# EAGLE design robot (EAGLE 6.1)
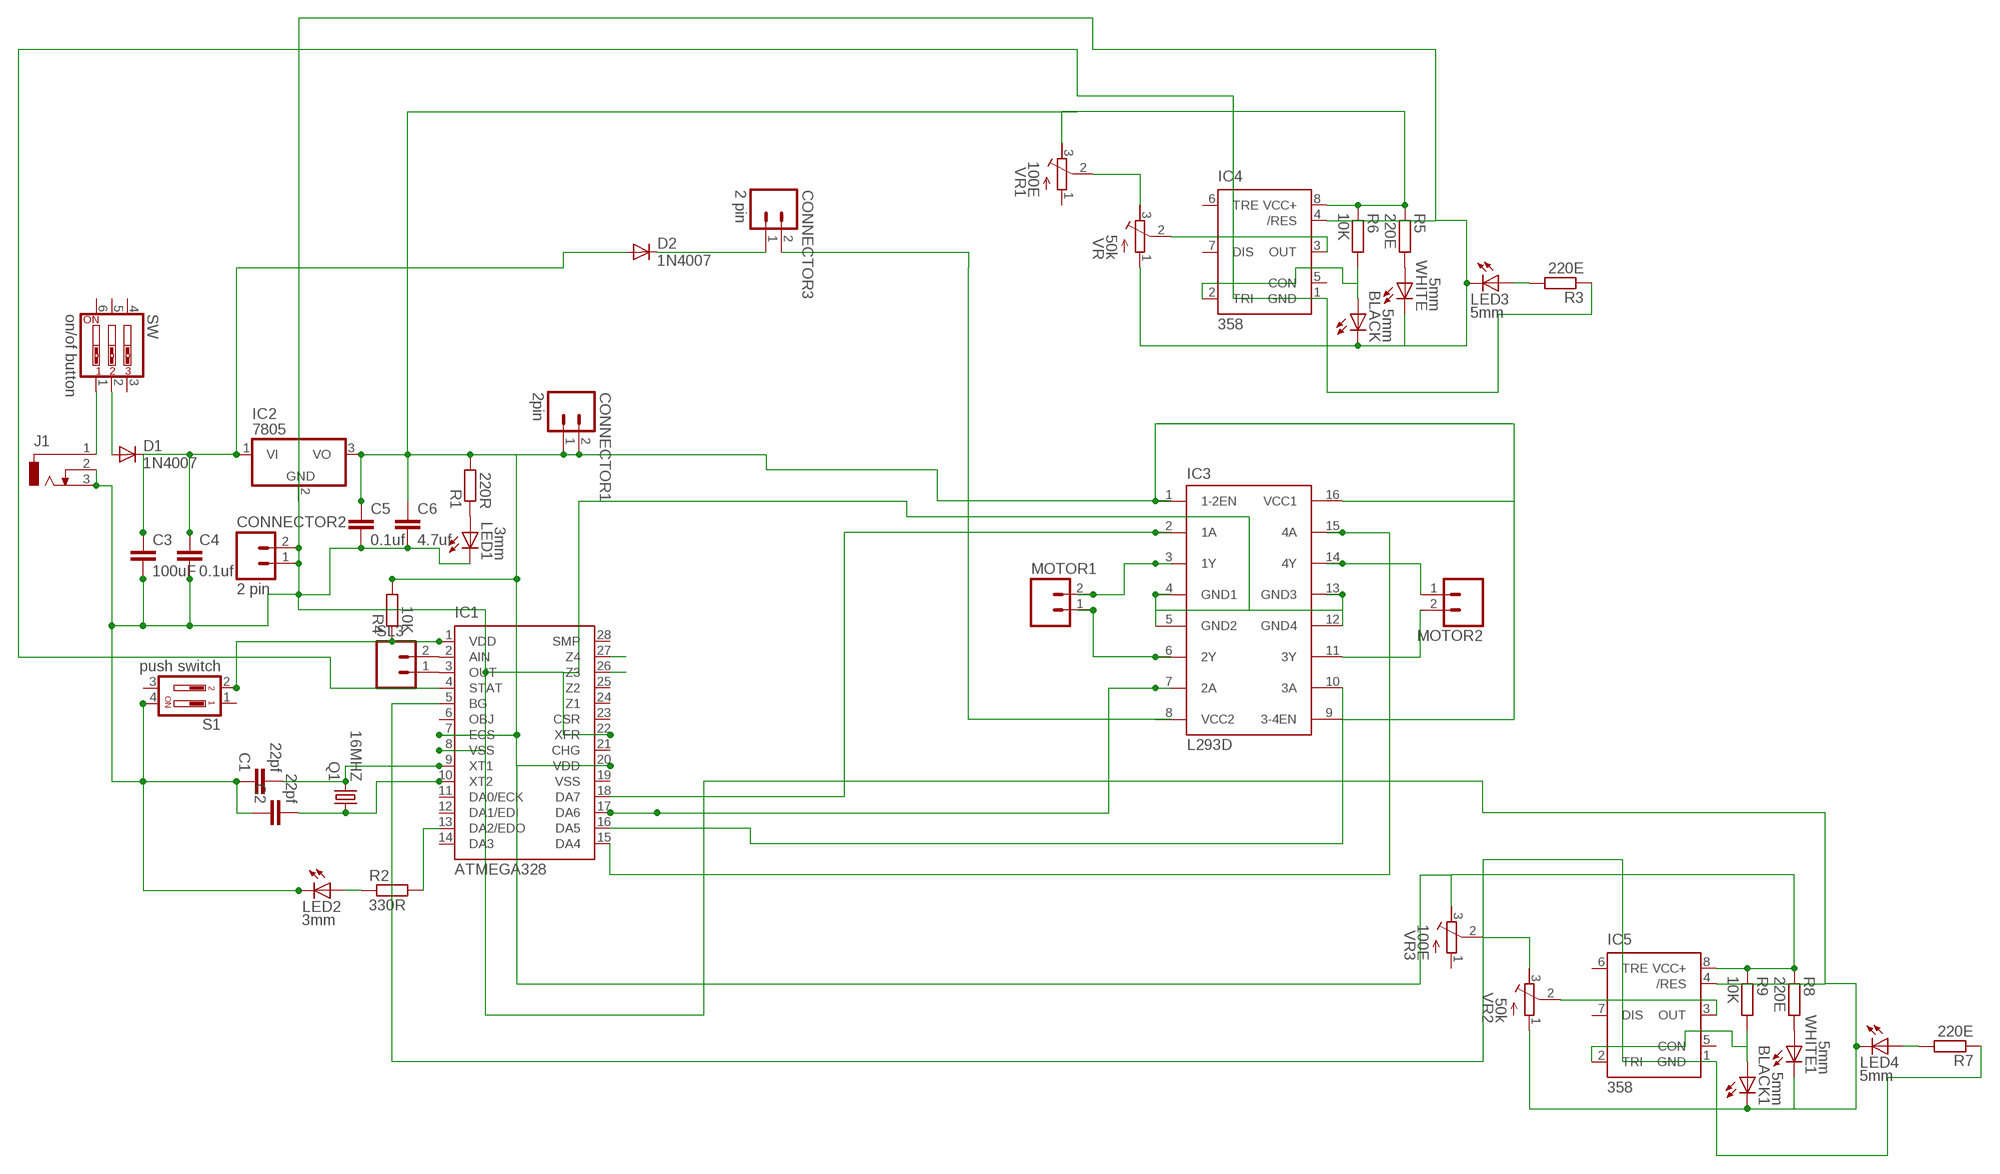
[diagram p0: schematic, sheet 1]

## Parts
BLACK  5mm  LED5MM  [LED5MM]
BLACK1  5mm  LED5MM  [LED5MM]
C1  22pf  C2.5/2  [C2.5-2]
C2  22pf  C2.5/2  [C2.5-2]
C3  100uF  C2.5/2  [C2.5-2]
C4  0.1uf  C2.5/2  [C2.5-2]
C5  0.1uf  C2.5/2  [C2.5-2]
C6  4.7uf  C2.5/2  [C2.5-2]
CONNECTOR1  2pin  M02  [02P]
CONNECTOR2  2 pin  M02  [02P]
CONNECTOR3  2 pin  M02  [02P]
D1  1N4007  1N4004  [DO41-10]
D2  1N4007  1N4004  [DO41-10]
IC1  ATMEGA328  QT9701BD  [DIL28-3]
IC2  7805  786TV  [TO220V]
IC3  L293D  [DIL16]
IC4  358  NE555  [DIL-08]
IC5  358  NE555  [DIL-08]
J1  DCJ0303  [DCJ0303]
LED1  3mm  LED3MM  [LED3MM]
LED2  3mm  LED3MM  [LED3MM]
LED3  5mm  LED5MM  [LED5MM]
LED4  5mm  LED5MM  [LED5MM]
MOTOR1  M02  [02P]
MOTOR2  M02  [02P]
Q1  16MHZ  CRYSTALHC49S  [HC49/S]
R1  220R  R-EU_0207/10  [0207/10]
R2  330R  R-EU_0207/10  [0207/10]
R3  220E  R-EU_0204/7  [0204/7]
R4  10K  R-EU_0207/10  [0207/10]
R5  220E  R-EU_0204/7  [0204/7]
R6  10K  R-EU_0204/7  [0204/7]
R7  220E  R-EU_0204/7  [0204/7]
R8  220E  R-EU_0204/7  [0204/7]
R9  10K  R-EU_0204/7  [0204/7]
S1  push switch  DP02  [DP-02]
SL3  M02  [02P]
SW  on/of button  SW_DIP-3  [EDG-03]
VR  50k  R-TRIMM64P  [RTRIM64P]
VR1  100E  R-TRIMM64P  [RTRIM64P]
VR2  50k  R-TRIMM64P  [RTRIM64P]
VR3  100E  R-TRIMM64P  [RTRIM64P]
WHITE  5mm  LED5MM  [LED5MM]
WHITE1  5mm  LED5MM  [LED5MM]

## Nets
N$1: C1.2 IC1.9(XT1) Q1.2
N$2: C2.2 IC1.10(XT2) Q1.1
N$3: J1.1 SW.1
N$4: CONNECTOR3.2 IC3.8(VCC2)
N$5: C3.1 C4.1 D1.C D2.A IC2.1(VI)
N$6: LED1.A R1.1
N$7: IC1.17(DA6) IC3.7(2A)
N$8: IC1.3(OUT) SL3.1
N$9: IC1.2(AIN) SL3.2
N$10: CONNECTOR3.1 D2.C
N$12: IC1.27(Z4)
N$13: IC1.26(Z3)
N$15: IC1.18(DA7) IC3.2(1A)
N$16: IC1.15(DA4) IC3.15(4A)
N$17: IC1.13(DA2/EDO) R2.2
N$18: D1.A SW.2
N$20: IC1.4(STAT) IC4.1(GND) R3.1
N$21: IC1.16(DA5) IC3.10(3A)
N$22: R5.2 WHITE.A
N$23: BLACK.A IC4.2(TRI) R6.2
N$24: IC4.3(OUT) VR.2(S)
N$25: IC3.14(4Y) MOTOR2.1
N$26: VR1.2(S) VR.3(A)
N$28: IC3.11(3Y) MOTOR2.2
N$29: LED3.A R3.2
N$31: IC1.1(VDD) R4.1 S1.2
N$32: LED2.A R2.1
N$33: C5.1 C6.1 CONNECTOR1.1 CONNECTOR1.2 IC1.7(ECS) IC1.20(VDD) IC2.3(VO) IC3.1(1-2EN) IC3.9(3-4EN) IC3.16(VCC1) IC4.8(VCC+) IC5.8(VCC+) R1.2 R4.2 R5.1 R6.1 R8.1 R9.1 VR1.3(A) VR3.3(A)
N$34: IC3.6(2Y) MOTOR1.1
N$35: IC3.3(1Y) MOTOR1.2
N$36: IC1.5(BG) IC5.1(GND) R7.1
N$37: R8.2 WHITE1.A
N$38: BLACK1.A IC5.2(TRI) R9.2
N$39: IC5.3(OUT) VR2.2(S)
N$40: VR2.3(A) VR3.2(S)
N$41: BLACK1.K(C) BLACK.K(C) C1.1 C2.1 C3.2 C4.2 C5.2 C6.2 CONNECTOR2.1 CONNECTOR2.2 IC1.8(VSS) IC1.22(XFR) IC2.2(GND) IC3.4(GND1) IC3.5(GND2) IC3.12(GND4) IC3.13(GND3) IC4.4(/RES) IC5.4(/RES) J1.2 J1.3 LED1.K(C) LED2.K(C) LED3.K(C) LED4.K(C) S1.4 VR2.1(E) VR.1(E) WHITE1.K(C) WHITE.K(C)
N$42: LED4.A R7.2
Unconnected: IC1.6(OBJ) IC1.11(DA0/ECK) IC1.12(DA1/EDI) IC1.14(DA3) IC1.19(VSS) IC1.21(CHG) IC1.23(CSR) IC1.24(Z1) IC1.25(Z2) IC1.28(SMP) IC4.5(CON) IC4.6(TRE) IC4.7(DIS) IC5.5(CON) IC5.6(TRE) IC5.7(DIS) S1.1 S1.3 SW.3 SW.4 SW.5 SW.6 VR1.1(E) VR3.1(E)

## Library data of the parts
BLACK BLACK1 LED1-LED4 WHITE WHITE1 = led:LED: LED OSRAM: - CHIPLED LG R971, LG N971, LY N971, LG Q971, LY Q971, LO R971, LY R971 LH N974, LH R974 LS Q976, LO Q976, LY Q976 LO Q996 - Hyper CHIPLED LW Q18S LB Q993, LB Q99A, LB R99A - SideLED LS A670, LO A670, LY A670, LG A670, LP A670 LB A673, LV A673, LT A673, LW A673 LH A674 LY A675 LS A676, LA A676, LO A676, LY A676, LW A676 LS A679, LY A679, LG A679 - Hyper Micro SIDELED® LS Y876, LA Y876, LO Y876, LY Y876 LT Y87S - SmartLED LW L88C, LW L88S LB L89C, LB L89S, LG L890 LS L89K, LO L89K, LY L89K LS L896, LA L896, LO L896, LY L896 - TOPLED LS T670, LO T670, LY T670, LG T670, LP T670 LSG T670, LSP T670, LSY T670, LOP T670, LYG T670 LG T671, LOG T671, LSG T671 LB T673, LV T673, LT T673, LW T673 LH T674 LS T676, LA T676, LO T676, LY T676, LB T676, LH T676, LSB T676, LW T676 LB T67C, LV T67C, LT T67C, LS T67K, LO T67K, LY T67K, LW E67C LS E67B, LA E67B, LO E67B, LY E67B, LB E67C, LV E67C, LT E67C LW T67C LS T679, LY T679, LG T679 LS T770, LO T770, LY T770, LG T770, LP T770 LB T773, LV T773, LT T773, LW T773 LH T774 LS E675, LA E675, LY E675, LS T675 LS T776, LA T776, LO T776, LY T776, LB T776 LHGB T686 LT T68C, LB T68C - Hyper Mini TOPLED® LB M676 - Mini TOPLED Santana® LG M470 LS M47K, LO M47K, LY M47K Source: http://www.osram.convergy.de LUXEON: - LUMILED® LXK2-PW12-R00, LXK2-PW12-S00, LXK2-PW14-U00, LXK2-PW14-V00 LXK2-PM12-R00, LXK2-PM12-S00, LXK2-PM14-U00 LXK2-PE12-Q00, LXK2-PE12-R00, LXK2-PE12-S00, LXK2-PE14-T00, LXK2-PE14-U00 LXK2-PB12-K00, LXK2-PB12-L00, LXK2-PB12-M00, LXK2-PB14-N00, LXK2-PB14-P00, LXK2-PB14-Q00 LXK2-PR12-L00, LXK2-PR12-M00, LXK2-PR14-Q00, LXK2-PR14-R00 LXK2-PD12-Q00, LXK2-PD12-R00, LXK2-PD12-S00 LXK2-PH12-R00, LXK2-PH12-S00 LXK2-PL12-P00, LXK2-PL12-Q00, LXK2-PL12-R00 Source: www.luxeon.com KINGBRIGHT: KA-3528ASYC Source: www.kingbright.com
C1-C6 = capacitor-wima:C: CAPACITOR naming: grid - package width
CONNECTOR1-CONNECTOR3 MOTOR1 MOTOR2 SL3 = con-amp-quick:M02: AMP QUICK CONNECTOR; OC_FARNELL: unknown; OC_NEWARK: unknown
D1 D2 = diode:1N4004: DIODE general purpose rectifier, 1 A
IC1 = quantum-research-group:QT9701B: Charge-Transfer Capacitance Sensor IC Source: http://data.qprox.com/downloads/datasheets/qt9701b.pdf; OC_FARNELL: unknown; OC_NEWARK: unknown
IC2 = linear:78*: Positive VOLTAGE REGULATOR Source: http://cache.national.com/ds/LM/LM78L05.pdf http://www.fairchildsemi.com/ds/LM/LM7805.pdf
IC3 = st-microelectronics:L293D: PUSH-PULL 4 CHANNEL DRIVER; MPN: L293D; OC_FARNELL: 9589619; OC_NEWARK: 56P8249
IC4 IC5 = st-microelectronics:NE555: General purpose bipolar Timer; MF: Arrow Electronics; MPN: NE555N; OC_FARNELL: 1467742; OC_NEWARK: 89K1486
J1 = con-jack:DCJ0303: DC POWER JACK Source: DCJ0303.pdf; OC_FARNELL: unknown; OC_NEWARK: unknown
Q1 = crystal:CRYSTAL: CRYSTAL; OC_FARNELL: 1667008; OC_NEWARK: unknown
R1-R9 = rcl:R-EU_: RESISTOR, European symbol
S1 = switch-dil:DP02: DIL/CODE SWITCH; MPN: MCDP02; OC_FARNELL: 1255233; OC_NEWARK: 26M1095
SW = special:SW_DIP-3: DIP SWITCH
VR VR1-VR3 = resistor:R-TRIMM: Trimm resistor

## Board
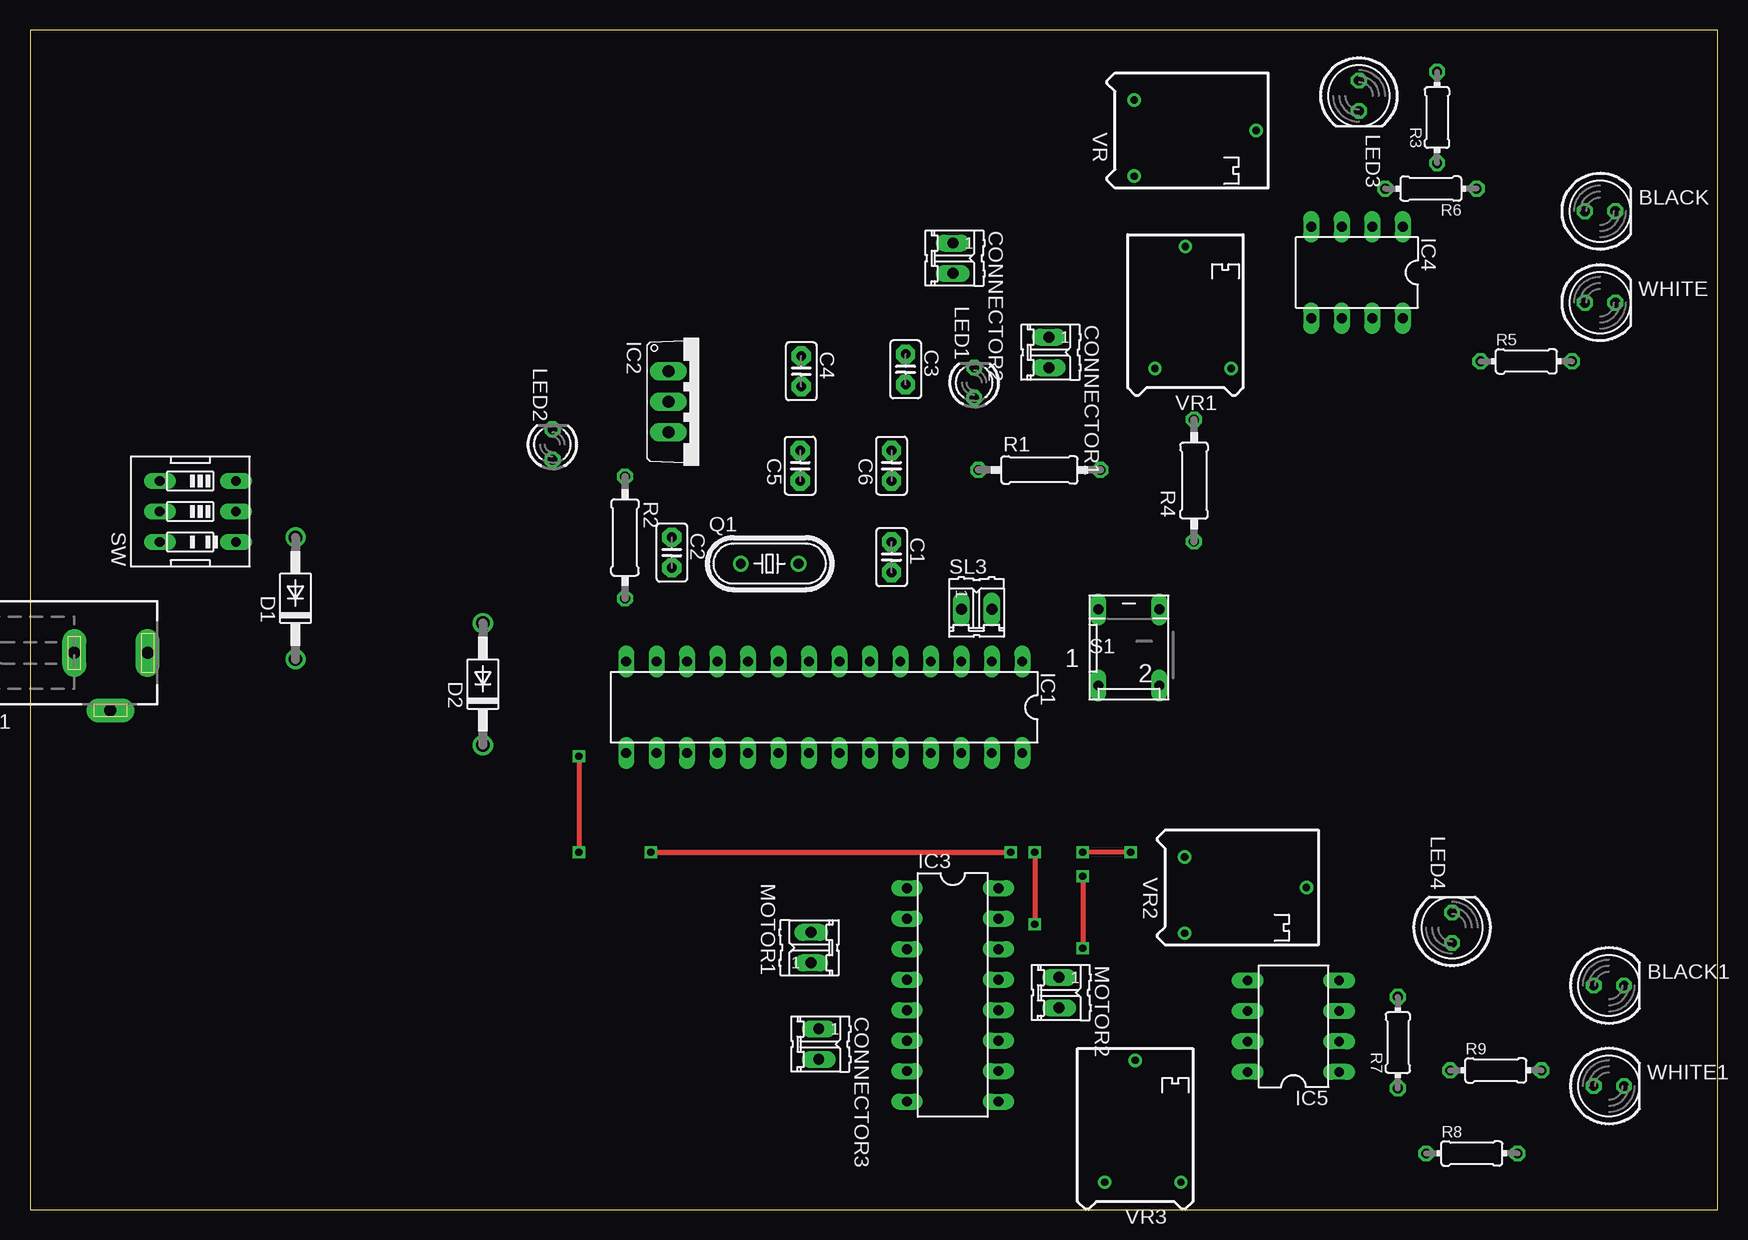
[diagram p1: board, top side]
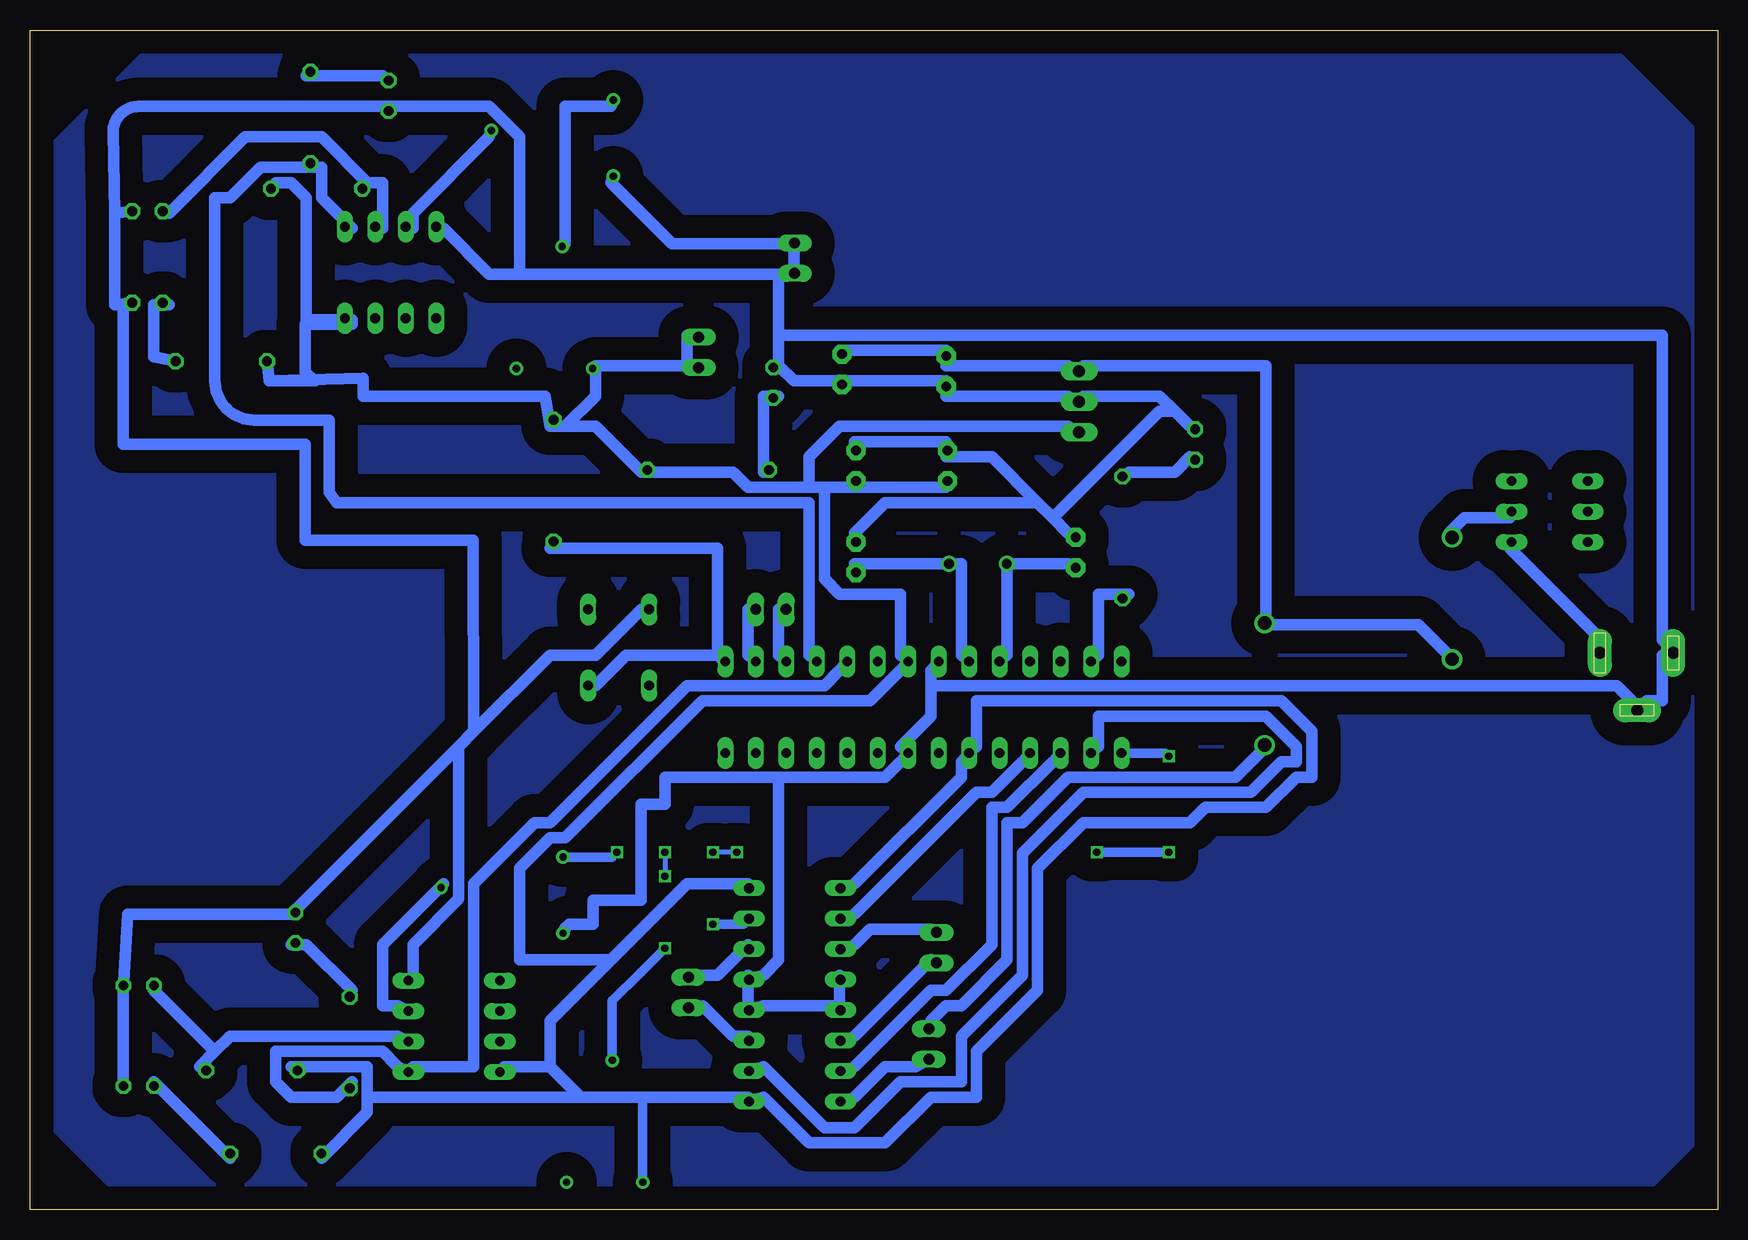
[diagram p2: board, bottom side, seen from below]

Size 140.67 x 98.32 mm. Coordinates in mm from the lower left corner, seen from the top.
Outline: 0,0 140.67,0 140.67,98.32 0,98.32 0,0
Copper layers (1*16): Top 0.035mm / dielectric 1.5mm / Bottom 0.035mm
Design rules: minimum track width 37mil, minimum drill 24mil, track to track 8mil, track to pad 8mil, pad to pad 8mil, via to via 8mil, smd to smd 8mil, copper to edge 40mil, drill to drill 8mil, minimum pad ring 10mil, minimum via ring 8mil, stop-mask expansion 4mil, vias tented up to drill 0mil, thermal gap 10mil

### Footprints (pad centres in the part's own frame; a part is rotated, then mirrored left to right if it is on the bottom)
LED5MM = drill 0.813 octagon: A -1.27,0; K 1.27,0
C2.5-2 = drill 0.813 pad 1.6 octagon: 1 -1.27,0; 2 1.27,0
02P = drill 0.914 long: 1 -1.27,0; 2 1.27,0
DO41-10 = drill 1.118: A 5.08,0; C -5.08,0
DIL28-3 = drill 0.813 long: 1 -16.51,-3.81; 2 -13.97,-3.81; 3 -11.43,-3.81; 4 -8.89,-3.81; 5 -6.35,-3.81; 6 -3.81,-3.81; 7 -1.27,-3.81; 8 1.27,-3.81; 9 3.81,-3.81; 10 6.35,-3.81; 11 8.89,-3.81; 12 11.43,-3.81; 13 13.97,-3.81; 14 16.51,-3.81; 15 16.51,3.81; 16 13.97,3.81; 17 11.43,3.81; 18 8.89,3.81; 19 6.35,3.81; 20 3.81,3.81; 21 1.27,3.81; 22 -1.27,3.81; 23 -3.81,3.81; 24 -6.35,3.81; 25 -8.89,3.81; 26 -11.43,3.81; 27 -13.97,3.81; 28 -16.51,3.81
TO220V = drill 1.016 long: 1 -2.54,-2.54; 2 0,-2.54; 3 2.54,-2.54
DIL16 = drill 0.813 long: 1 -8.89,-3.81; 2 -6.35,-3.81; 3 -3.81,-3.81; 4 -1.27,-3.81; 5 1.27,-3.81; 6 3.81,-3.81; 7 6.35,-3.81; 8 8.89,-3.81; 9 8.89,3.81; 10 6.35,3.81; 11 3.81,3.81; 12 1.27,3.81; 13 -1.27,3.81; 14 -3.81,3.81; 15 -6.35,3.81; 16 -8.89,3.81
DIL-08 = drill 0.813 long: 1 -3.81,-3.81; 2 -1.27,-3.81; 3 1.27,-3.81; 4 3.81,-3.81; 5 3.81,3.81; 6 1.27,3.81; 7 -1.27,3.81; 8 -3.81,3.81
DCJ0303 = drill 1 pad 2 long: 1 0,3.1; 2 4.8,0; 3 0,-3
LED3MM = drill 0.813 octagon: A -1.27,0; K 1.27,0
HC49/S = drill 0.813: 1 -2.413,0; 2 2.413,0
0207/10 = drill 0.813 octagon: 1 -5.08,0; 2 5.08,0
0204/7 = drill 0.813 octagon: 1 -3.81,0; 2 3.81,0
DP-02 = drill 0.813 long: 1 -2.54,-2.54; 2 2.54,-2.54; 3 2.54,3.81; 4 -2.54,3.81
EDG-03 = drill 0.813 long: 1 -2.54,-3.81; 2 0,-3.81; 3 2.54,-3.81; 4 2.54,2.54; 5 0,2.54; 6 -2.54,2.54
RTRIM64P = drill 0.61: 1 -2.54,-3.81; 2 7.62,0; 3 -2.54,2.54

### Placement (x,y rotation side)
BLACK  130.88,83.22 0 top
BLACK1  131.61,18.7 0 top
C1  71.82,54.39 270 top
C2  53.5,54.77 270 top
C3  72.99,70.04 270 top
C4  64.29,69.88 270 top
C5  64.2,62.01 90 top
C6  71.82,62.01 90 top
CONNECTOR1  84.93,71.46 270 top
CONNECTOR2  76.93,79.3 270 top
CONNECTOR3  65.75,13.81 270 top
D1  22.13,50.96 90 top
D2  37.75,43.81 90 top
IC1  66.2,41.88 180 top
IC2  55.76,67.33 270 top
IC3  76.92,17.91 270 top
IC4  110.62,78.11 180 top
IC5  105.32,15.3 90 top
J1  6.7,46.42 270 top
LED1  78.71,68.93 90 top
LED2  43.55,63.78 90 top
LED3  110.78,92.84 270 top
LED4  118.54,23.51 90 top
MOTOR1  65.11,21.85 90 top
MOTOR2  85.79,18.1 270 top
Q1  61.66,53.85 0 top
R1  84.14,61.66 0 top
R2  49.6,56.03 270 top
R3  117.29,91.03 90 top
R4  97.03,60.77 90 top
R5  124.72,70.71 0 top
R6  116.78,85.1 180 top
R7  114.02,13.94 90 top
R8  120.18,4.7 0 top
R9  122.18,11.62 0 top
S1  91.6,46.23 0 top
SL3  78.9,50.04 0 top
SW  13.36,58.19 90 top
VR  94.59,89.95 0 top
VR1  96.31,72.65 90 top
VR2  98.78,26.86 0 top
VR3  92.13,4.84 90 top
WHITE  130.88,75.6 0 top
WHITE1  131.61,10.32 0 top

### Tracks (layer width: path | path; a pad name or v marks a point on that pad's centre or on a via)
N$1
  Bottom 0.94: 64.3,53.85 Q1.2 | Q1.2 63.03,53.85 63.03,46.23 IC1.9 | 64.3,53.85 Q1.2 | 64.3,53.85 71.92,53.85 C1.2 | 64.3,53.85 Q1.2
N$2
  Bottom 0.94: 59.22,53.85 59.22,46.23 IC1.10 | 59.22,53.85 Q1.1 59.22,53.85 | 59.22,53.85 54.14,53.85 C2.2
N$3
  Bottom 0.94: SW.1 17.31,55.12 9.69,47.5 J1.1
N$4
  Bottom 0.94: IC3.8 71.92,9.4 69.38,11.94 66.84,11.94 CONNECTOR3.2
N$5
  Bottom 0.94: 37.63,48.77 24.93,48.77 22.39,46.23 D1.C | 37.63,48.77 D2.A 37.63,48.77 | C3.1 73.19,71.63 64.3,71.63 C4.1 64.3,70.36 54.14,70.36 IC2.1 52.87,70.36 37.63,70.36 37.63,48.77
N$6
  Bottom 0.94: R1.1 79.54,61.47 79.54,67.82 78.27,67.82 LED1.A
N$7
  Bottom 0.94: IC3.7 71.92,11.94 65.57,18.29 64.3,18.29 60.49,22.1 60.49,33.53 59.22,33.53 55.41,37.34 IC1.17
N$8
  Bottom 0.94: IC1.3 78.27,46.23 78.27,50.04 SL3.1
N$9
  Bottom 0.94: IC1.2 80.81,46.23 80.81,50.04 SL3.2
N$10
  Bottom 0.94: CONNECTOR3.1 65.57,15.75 64.3,17.02 63.03,17.02 59.22,20.83 59.22,32.26 57.95,32.26 54.14,36.07 40.17,36.07 37.63,38.61 D2.C
N$11
  pour Bottom (isolate 1.93): 9.75,-0.19 7.75,-0.19 -0.25,7.81 -0.25,87.81 9.75,97.81 129.75,97.81 139.75,87.81 139.75,7.81 131.75,-0.19
N$15
  Bottom 0.94: IC1.18 57.95,37.34 60.49,34.8 61.76,34.8 71.92,24.64 IC3.2
N$16  (via drill 0.6)
  Top 0.406: v45.75,37.81 v45.75,29.81 | v51.75,29.81 v81.75,29.81 | v83.75,29.81 v83.75,23.81
  Bottom 0.406: 46.01,38.07 v45.75,37.81 | v81.75,29.81 v83.75,29.81 | 81.18,23.81 IC3.15
  Bottom 0.806: IC1.15 46.01,38.07 | v45.75,29.81 v51.75,29.81 | v83.75,23.81 81.18,23.81
N$17
  Bottom 0.94: IC1.13 51.6,46.23 51.6,51.31 49.06,51.31 R2.2
N$18
  Bottom 0.94: SW.2 17.31,57.66 21.12,57.66 22.39,56.39 D1.A
N$20
  Bottom 0.94: 117.64,86.87 121.45,86.87 123.99,84.33 125.26,84.33 125.26,69.09 arc-90 121.98,65.81 115.75,65.81 115.75,59.81 115.1,58.93 75.73,58.93 75.73,46.23 IC1.4 | 117.64,86.87 R3.1 117.64,86.87 | 117.64,86.87 116.37,86.87 116.37,84.33 113.83,81.79 IC4.1
N$21
  Bottom 0.94: IC1.16 51.6,38.61 51.6,41.15 37.63,41.15 35.09,38.61 35.09,37.34 36.36,37.34 38.9,34.8 52.87,34.8 57.95,29.72 57.95,19.56 63.03,14.48 63.03,10.67 68.11,10.67 71.92,6.86 74.46,6.86 79.54,11.94 IC3.10
N$22
  Bottom 0.94: R5.2 130.34,71.09 130.34,75.44 129.07,75.44 WHITE.A
N$23
  Bottom 0.94: 112.56,85.6 111.29,85.6 111.29,81.79 IC4.2 | 112.56,85.6 R6.2 112.56,85.6 | 112.56,85.6 116.37,89.41 122.72,89.41 129.07,83.06 BLACK.A
N$24
  Bottom 0.94: VR.2 102.4,89.41 108.75,83.06 108.75,81.79 IC4.3
N$25
  Bottom 0.94: IC3.14 80.81,22.1 83.35,19.56 84.62,19.56 MOTOR2.1
N$26
  Bottom 0.94: VR1.2 96.05,80.52 96.05,91.95 92.24,91.95 VR.3
N$28
  Bottom 0.94: IC3.11 80.81,14.48 82.08,14.48 84.62,17.02 MOTOR2.2
N$29
  Bottom 0.94: LED3.A 111.29,94.49 117.64,94.49 R3.2
N$31
  Bottom 0.94: 83.35,46.23 83.35,55.12 97.32,55.12 R4.1 | 83.35,46.23 IC1.1 83.35,46.23 | 83.35,46.23 90.97,46.23 93.51,43.69 S1.2
N$32
  Bottom 0.94: LED2.A 43.98,62.74 45.25,61.47 49.06,61.47 R2.1
N$33
  Bottom 0.406: 89.59,9.24 93.75,9.4
  Bottom 0.806: VR3.3 89.59,9.24
  Bottom 0.94: 85.89,70.36 93.51,70.36 | 93.51,70.36 VR1.3 93.51,70.36 | 85.89,70.36 CONNECTOR1.2 85.89,70.36 | 85.89,70.36 85.89,72.9 CONNECTOR1.1 | 71.92,60.2 64.3,60.2 C5.1 | 71.92,60.2 C6.1 71.92,60.2 | 74.46,60.2 74.46,52.58 73.19,51.31 68.11,51.31 68.11,46.23 IC1.7 68.11,44.96 70.65,42.42 84.62,42.42 96.05,30.99 97.32,30.99 99.86,28.45 99.86,20.83 92.24,20.83 | 71.92,60.2 74.46,60.2 | 89.7,61.47 82.08,61.47 80.81,60.2 75.73,60.2 | 74.46,60.2 75.73,60.2 | 89.7,61.47 R1.2 89.7,61.47 | 96.05,65.28 93.51,65.28 89.7,61.47 | 96.05,65.28 97.32,65.28 | 97.32,65.28 R4.2 97.32,65.28 | 120.72,69.09 112.91,69.28 112.91,67.81 97.75,67.81 97.32,65.28 | 120.72,69.09 R5.1 120.72,69.09 | 113.83,74.17 113.83,73.81 117.75,73.81 117.75,69.81 116.91,69.09 120.72,69.09 | 113.83,74.17 IC4.8 113.83,74.17 | 113.83,74.17 117.64,74.17 117.64,84.33 118.91,85.6 120.18,85.6 R6.1 | 75.73,60.2 75.73,62.74 73.19,65.28 54.14,65.28 IC2.3 | 93.51,70.36 93.51,67.82 96.05,65.28 | IC3.1 71.92,27.18 63.03,36.07 63.03,37.34 IC1.20 61.76,38.61 61.76,42.42 36.36,42.42 33.82,39.88 33.82,36.07 35.09,36.07 37.63,33.53 42.71,33.53 43.98,32.26 52.87,32.26 56.68,28.45 56.68,18.29 61.76,13.21 61.76,9.4 65.57,9.4 69.38,5.59 75.73,5.59 79.54,9.4 IC3.9 80.81,9.4 93.75,9.4 94.78,9.4 | 112.56,9.4 112.56,11.94 118.91,11.94 R9.1 | 112.56,9.4 112.56,8.13 116.37,4.32 R8.1 | 97.32,11.94 94.78,9.4 | 97.32,11.94 101.13,11.94 IC5.8 | 92.24,20.83 97.32,15.75 97.32,11.94 | 92.24,20.83 85.89,27.18 80.81,27.18 IC3.16 | 94.78,9.4 112.56,9.4
N$34
  Bottom 0.94: IC3.6 71.92,14.48 65.57,20.83 MOTOR1.1
N$35
  Bottom 0.94: IC3.3 71.92,22.1 70.65,23.37 65.57,23.37 MOTOR1.2
N$36
  Bottom 0.94: R7.1 113.83,10.67 115.1,9.4 118.91,9.4 120.18,10.67 120.18,13.21 111.29,13.21 110.02,11.94 IC5.1 108.75,11.94 103.67,11.94 103.67,27.18 98.59,32.26 97.32,32.26 85.89,43.69 74.46,43.69 73.19,44.96 IC1.5
N$37
  Bottom 0.94: R8.2 123.99,4.32 130.34,10.67 WHITE1.A
N$38
  Bottom 0.94: 125.26,13.21 126.53,11.94 R9.2 | 125.26,13.21 123.99,14.48 110.02,14.48 IC5.2 | 125.26,13.21 130.34,18.29 BLACK1.A
N$39
  Bottom 0.94: VR2.2 106.21,27.18 111.29,22.1 111.29,17.02 110.02,17.02 IC5.3
N$40  (via drill 0.6)
  Top 0.406: v91.75,29.81 v87.75,29.81 | v87.75,27.81 v87.75,21.81
  Bottom 0.406: 92.16,29.4 v91.75,29.81 | v87.75,29.81 87.75,29.4 v87.75,27.81
  Bottom 0.806: VR2.3 92.16,29.4 | v87.75,21.81 89.75,19.81 92.13,17.43 VR3.2
N$41
  Bottom 0.94: 73.19,17.02 73.19,19.56 IC3.4 | 73.19,17.02 IC3.5 73.19,17.02 | 73.19,17.02 79.54,17.02 IC3.12 80.81,17.02 80.81,19.56 IC3.13 79.54,19.56 78.27,20.83 78.27,36.07 | 78.27,36.07 69.38,36.07 68.11,37.34 IC1.22 68.11,38.61 65.57,41.15 65.57,43.69 | 78.27,36.07 83.35,36.07 87.75,36.07 87.75,33.81 89.75,33.81 89.75,29.81 89.75,25.81 93.75,25.81 93.75,23.81 95.75,23.81 96.05,23.51 96.05,23.37 VR2.1 | 65.57,43.69 65.57,44.96 IC1.8 | 65.57,43.69 8.42,43.69 7.15,42.42 J1.2 5.88,42.42 4.61,42.42 4.61,46.23 J1.3 4.61,47.5 4.61,72.9 78.27,72.9 | 132.88,18.29 132.88,10.67 WHITE1.K | 132.88,18.29 BLACK1.K 132.88,18.29 | 118.91,24.64 104.94,38.61 | 104.94,38.61 103.67,39.88 | 103.67,39.88 97.32,46.23 93.51,46.23 89.7,50.04 S1.4 | 118.91,24.64 LED4.K 118.91,24.64 | 104.94,38.61 104.94,25.91 108.75,22.1 108.75,19.56 IC5.4 | 132.88,18.29 132.53,24.64 118.91,24.64 | 56.68,58.93 60.49,62.74 64.3,62.74 C5.2 64.3,64.01 71.92,64.01 C6.2 | 56.68,58.93 55.41,57.66 | 55.41,57.66 54.14,56.39 C2.1 | 56.68,58.93 69.38,58.93 71.92,56.39 C1.1 | 45.25,66.55 46.52,67.82 52.87,67.82 IC2.2 54.14,67.82 64.3,67.82 C4.2 64.3,69.09 73.19,69.09 | 45.25,66.55 43.98,65.28 LED2.K | 78.27,70.36 77,69.09 73.19,69.09 | 78.27,70.36 LED1.K 78.27,70.36 | 73.19,69.09 C3.2 73.19,69.09 | 55.41,57.66 46.52,66.55 45.25,66.55 | 77,80.52 87.16,80.52 92.24,85.6 VR.1 | 77,80.52 CONNECTOR2.1 77,80.52 | 133.61,83.06 133.61,75.44 | 133.61,75.44 WHITE.K 133.61,75.44 | 133.61,83.06 BLACK.K 133.61,83.06 | 77,77.98 78.27,77.98 | 78.27,77.98 99.86,77.98 | 99.86,77.98 102.4,77.98 106.21,81.79 IC4.4 | 77,77.98 CONNECTOR2.2 | 111.29,91.95 102.4,91.95 99.86,89.41 99.86,77.98
  Bottom 0.94: 111.29,91.95 LED3.K 111.29,91.95 | 133.61,83.06 133.75,89.81 arc90 131.61,91.95 111.29,91.95 | 77,77.98 77,80.52 | 77,77.98 CONNECTOR2.2 | 78.27,77.98 78.27,72.9 | 78.27,72.9 78.27,70.36 | 78.27,77.98 CONNECTOR2.2 | 103.67,39.88 103.75,55.81 117.75,55.81 117.75,63.81 132.88,63.81 132.88,69.09 132.88,75.44 133.61,75.44
N$42
  Bottom 0.94: R7.2 113.83,18.29 117.64,22.1 118.91,22.1 LED4.A